# EAGLE schematic 4channelRock (EAGLE 7.1.0)
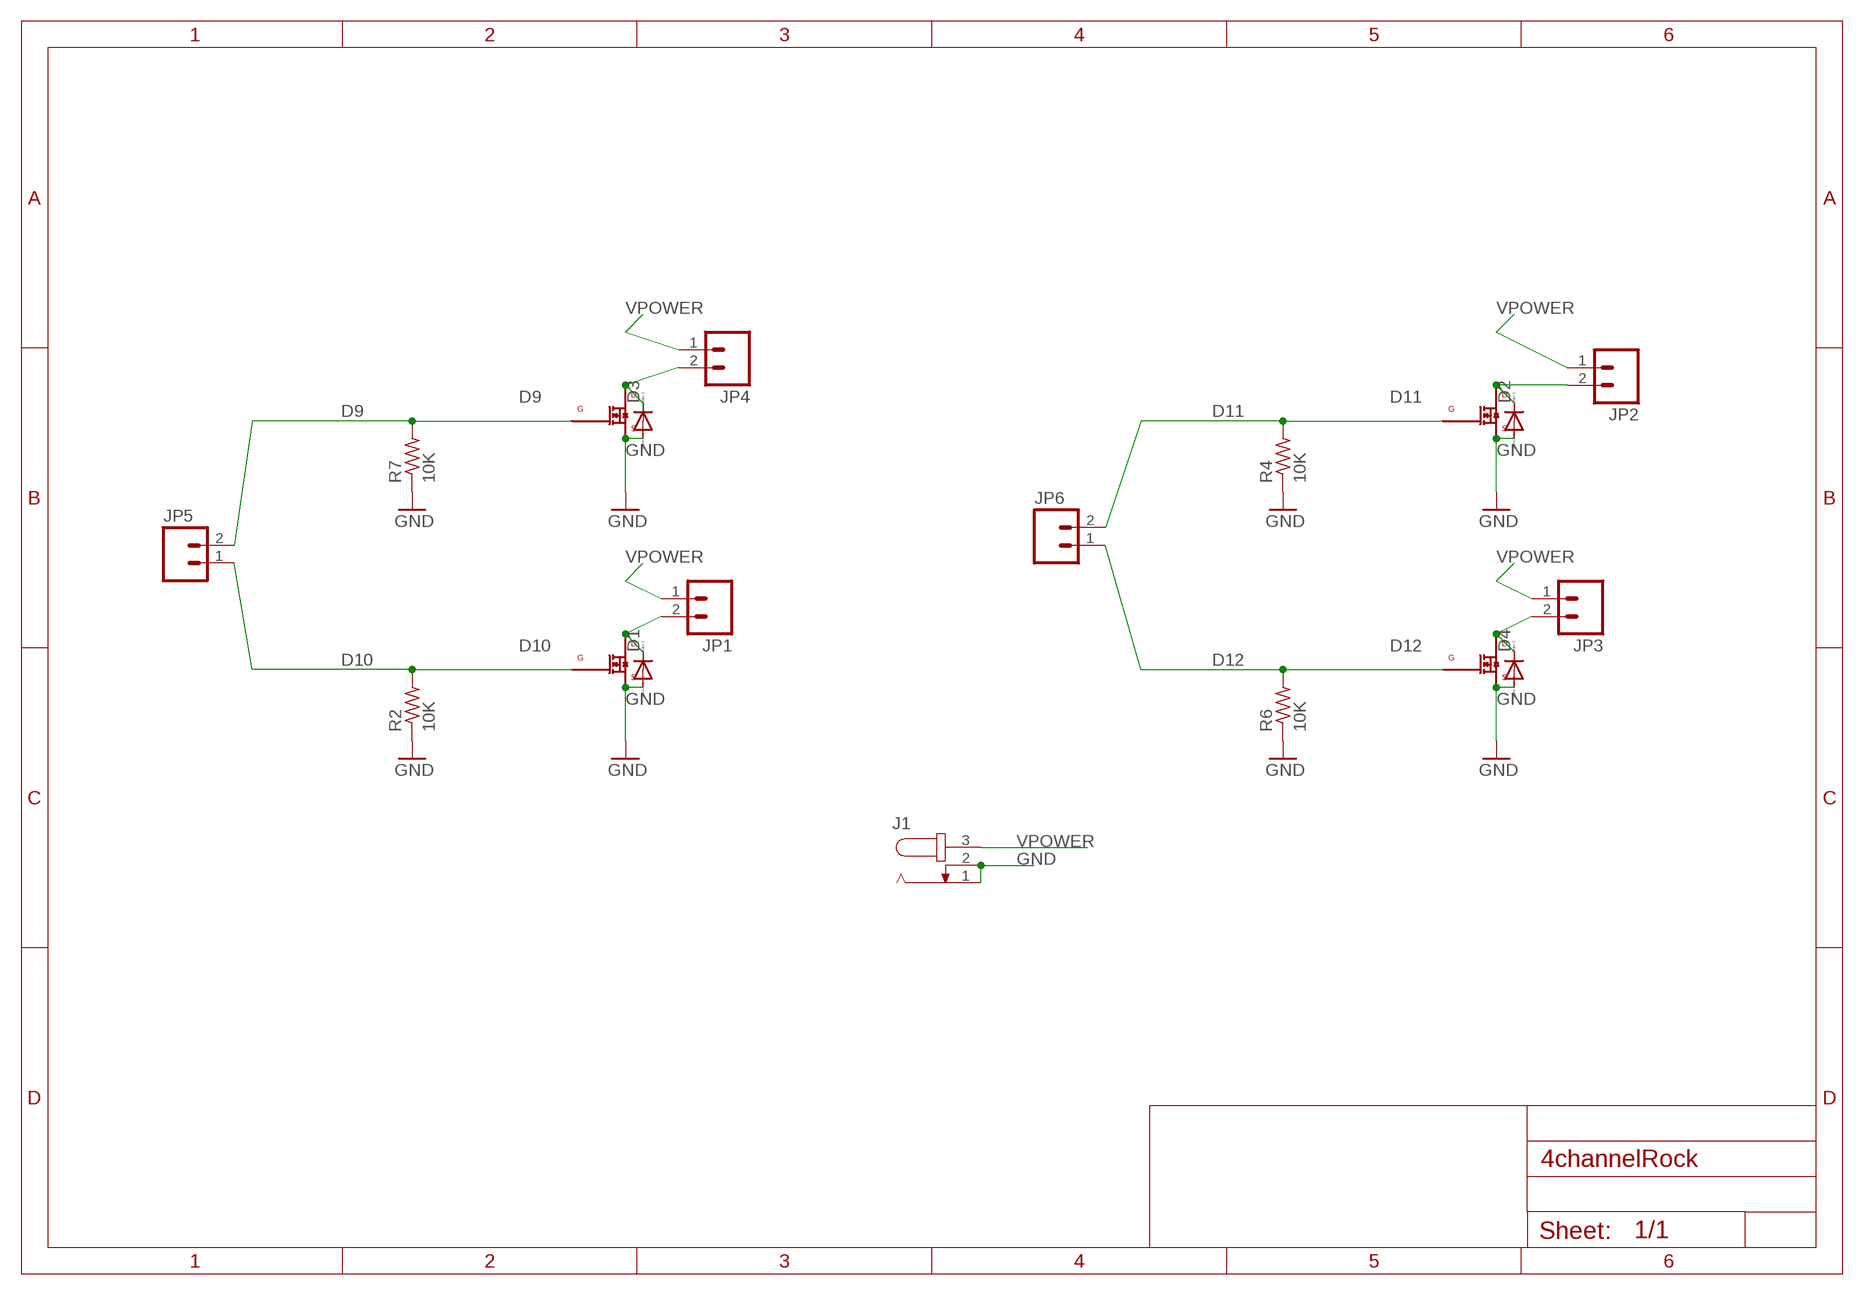
[diagram p0: schematic, sheet 1]

## Parts
D1  DIODE-DO-214AC  [DO-214AC]
D2  DIODE-DO-214AC  [DO-214AC]
D3  DIODE-DO-214AC  [DO-214AC]
D4  DIODE-DO-214AC  [DO-214AC]
J1  JACK-PLUG1  [SPC4078]
JP1  M02PTH  [1X02]
JP2  M02PTH  [1X02]
JP3  M02PTH  [1X02]
JP4  M02PTH  [1X02]
JP5  M02PTH  [1X02]
JP6  M02PTH  [1X02]
Q1  IRLML0060  [SOT-23]
Q2  IRLML0060  [SOT-23]
Q3  IRLML0060  [SOT-23]
Q4  IRLML0060  [SOT-23]
R2  10K  R-US_R0603  [R0603]
R4  10K  R-US_R0603  [R0603]
R6  10K  R-US_R0603  [R0603]
R7  10K  R-US_R0603  [R0603]

## Nets
D9: JP5.2 Q3.1(GATE) R7.2
D10: JP5.1 Q1.1(GATE) R2.2
D11: JP6.2 Q2.1(GATE) R4.2
D12: JP6.1 Q4.1(GATE) R6.2
GND: D1.A D2.A D3.A D4.A J1.1 J1.2 Q1.2(SOURCE) Q2.2(SOURCE) Q3.2(SOURCE) Q4.2(SOURCE) R2.1 R4.1 R6.1 R7.1
N$2: D3.C JP4.2 Q3.3(DRAIN)
N$3: D1.C JP1.2 Q1.3(DRAIN)
N$4: D2.C JP2.2 Q2.3(DRAIN)
N$10: D4.C JP3.2 Q4.3(DRAIN)
VPOWER: J1.3 JP1.1 JP2.1 JP3.1 JP4.1

## Library data of the parts
D1-D4 = diode:DIODE-: DIODE
J1 = con-jack:JACK-PLUG: DC POWER JACK Power Jack, DC, Right Angle, Through Hole, Rated 5A at 16VDC, PC Terminals Distributor: Farnell (www.Farnell.de) Drawing: 84N1161.pdf / 84N1162.pdf Manufacturer: SPC Technology (www.spctechnology.com) Type: SPC4077 / SPC 4078; OC_FARNELL: unknown; OC_NEWARK: unknown
JP1-JP6 = SparkFun-Connectors:M02: Standard 2-pin 0.1" header. Use with - straight break away headers ( PRT-00116) - right angle break away headers (PRT-00553) - swiss pins (PRT-00743) - machine pins (PRT-00117) - female headers (PRT-00115) Molex polarized connector foot print use with: PRT-08233 with associated crimp pins and housings. 2.54_SCREWTERM for use with PRT-10571. 3.5mm Screw Terminal footprints for PRT-08084 5mm Screw Terminal footprints for use with PRT-08432
Q1-Q4 = spietz-library:IRLML0060
R2 R4 R6 R7 = resistor:R-US_: RESISTOR, American symbol

## Net classes
0 default: width 0.203 mm
1 vcc: width 0.254 mm